# Altium schematic sheet LaserLider.SchDoc
size A4
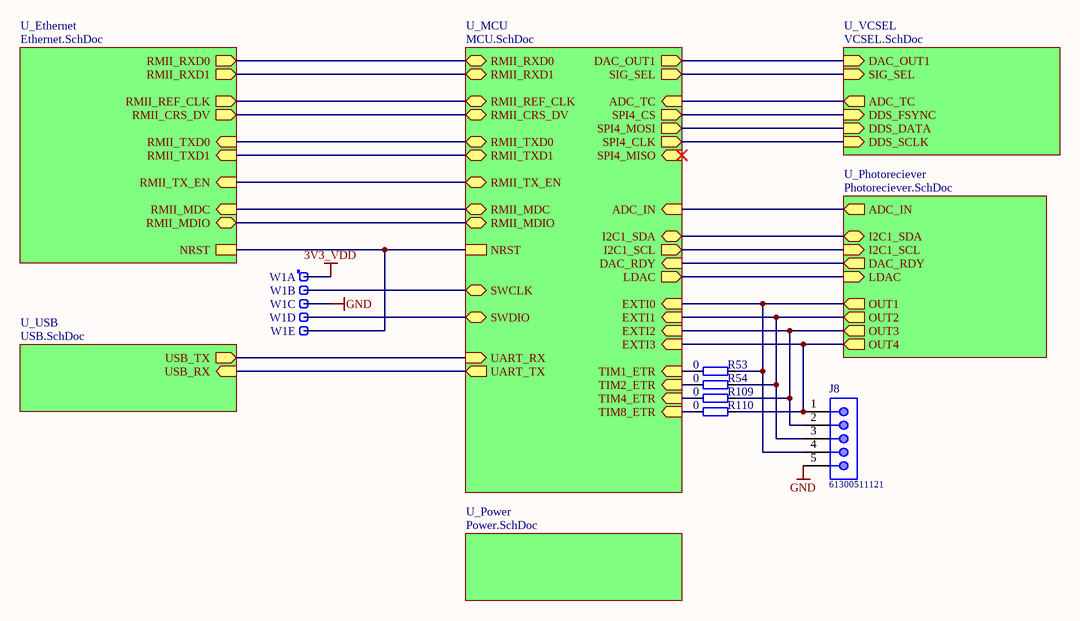
[diagram p0: LaserLider.SchDoc]

## Parts
J8  61300511121  [61300511121]
R53  0  [RESC1005X40N]
R54  0  [RESC1005X40N]
R109  0  [RESC1005X40N]
R110  0  [RESC1005X40N]
W1  Header 5  [SAMTEC_MTLW-105-07-L-S-250]  (value not drawn)  (parts A,B,C,D,E of 5)

## Sub-sheets
U_Ethernet = Ethernet.SchDoc: RMII_TXD0 (in), RMII_TX_EN (in), RMII_RXD0 (out), RMII_REF_CLK (out), RMII_CRS_DV (out), RMII_MDC (in), RMII_MDIO (bidir), NRST, RMII_TXD1 (in), RMII_RXD1 (out)
U_MCU = MCU.SchDoc: SWCLK (bidir), RMII_RXD0 (bidir), RMII_REF_CLK (bidir), RMII_CRS_DV (bidir), RMII_MDC (bidir), RMII_MDIO (bidir), RMII_RXD1 (bidir), SWDIO (bidir), RMII_TXD0 (bidir), RMII_TX_EN (bidir), RMII_TXD1 (bidir), NRST, DAC_OUT1 (out), UART_TX (out), UART_RX (in), ADC_IN (in), ADC_TC (in), SIG_SEL (out), EXTI3 (in), SPI4_CLK (out), I2C1_SCL (out), I2C1_SDA (bidir), DAC_RDY (in), SPI4_MOSI (out), EXTI1 (in), SPI4_MISO (in), LDAC (out), EXTI2 (in), EXTI0 (in), TIM8_ETR (in), TIM4_ETR (in), TIM1_ETR (in), TIM2_ETR (in), SPI4_CS (out)
U_Photoreciever = Photoreciever.SchDoc: ADC_IN (out), DAC_RDY (out), OUT2 (out), I2C1_SCL (in), LDAC (in), OUT3 (out), I2C1_SDA (bidir), OUT1 (out), OUT4 (out)
U_Power = Power.SchDoc: no entries
U_USB = USB.SchDoc: USB_TX (out), USB_RX (in)
U_VCSEL = VCSEL.SchDoc: DAC_OUT1 (in), ADC_TC (out), SIG_SEL (in), DDS_FSYNC (in), DDS_DATA (in), DDS_SCLK (in)

## Nets
3V3_VDD: W1.1
GND: J8.5 W1.3
NetJ8_1: J8.1 R110.2 ; sheet U_MCU/EXTI3, sheet U_Photoreciever/OUT4
NetJ8_2: J8.2 R109.2 ; sheet U_MCU/EXTI2, sheet U_Photoreciever/OUT3
NetJ8_3: J8.3 R54.2 ; sheet U_MCU/EXTI1, sheet U_Photoreciever/OUT2
NetJ8_4: J8.4 R53.2 ; sheet U_MCU/EXTI0, sheet U_Photoreciever/OUT1
NetR53_1: R53.1 ; sheet U_MCU/TIM1_ETR
NetR54_1: R54.1 ; sheet U_MCU/TIM2_ETR
NetR109_1: R109.1 ; sheet U_MCU/TIM4_ETR
NetR110_1: R110.1 ; sheet U_MCU/TIM8_ETR
NetW1_2: W1.2 ; sheet U_MCU/SWCLK
NetW1_4: W1.4 ; sheet U_MCU/SWDIO
NetW1_5: W1.5 ; sheet U_MCU/NRST, sheet U_Ethernet/NRST
(unnamed): sheet U_MCU/RMII_RXD0, sheet U_Ethernet/RMII_RXD0
(unnamed): sheet U_MCU/RMII_REF_CLK, sheet U_Ethernet/RMII_REF_CLK
(unnamed): sheet U_MCU/RMII_CRS_DV, sheet U_Ethernet/RMII_CRS_DV
(unnamed): sheet U_MCU/RMII_MDC, sheet U_Ethernet/RMII_MDC
(unnamed): sheet U_MCU/RMII_MDIO, sheet U_Ethernet/RMII_MDIO
(unnamed): sheet U_MCU/RMII_RXD1, sheet U_Ethernet/RMII_RXD1
(unnamed): sheet U_MCU/RMII_TXD0, sheet U_Ethernet/RMII_TXD0
(unnamed): sheet U_MCU/RMII_TX_EN, sheet U_Ethernet/RMII_TX_EN
(unnamed): sheet U_MCU/RMII_TXD1, sheet U_Ethernet/RMII_TXD1
(unnamed): sheet U_MCU/DAC_OUT1, sheet U_VCSEL/DAC_OUT1
(unnamed): sheet U_MCU/UART_TX, sheet U_USB/USB_RX
(unnamed): sheet U_MCU/UART_RX, sheet U_USB/USB_TX
(unnamed): sheet U_MCU/ADC_IN, sheet U_Photoreciever/ADC_IN
(unnamed): sheet U_MCU/ADC_TC, sheet U_VCSEL/ADC_TC
(unnamed): sheet U_MCU/SIG_SEL, sheet U_VCSEL/SIG_SEL
(unnamed): sheet U_MCU/SPI4_CLK, sheet U_VCSEL/DDS_SCLK
(unnamed): sheet U_MCU/I2C1_SCL, sheet U_Photoreciever/I2C1_SCL
(unnamed): sheet U_MCU/I2C1_SDA, sheet U_Photoreciever/I2C1_SDA
(unnamed): sheet U_MCU/DAC_RDY, sheet U_Photoreciever/DAC_RDY
(unnamed): sheet U_MCU/SPI4_MOSI, sheet U_VCSEL/DDS_DATA
(unnamed): sheet U_MCU/LDAC, sheet U_Photoreciever/LDAC
(unnamed): sheet U_MCU/SPI4_CS, sheet U_VCSEL/DDS_FSYNC

## Library data of the parts
J8 = 61300511121: WR-PHD Pin Header, THT, pitch 2.54mm, Single Row, Vertical, 5pin; Pin Number: 5; Gender: Male; Rated Current: 3A; Working Voltage: 250VAC; Withstanding Voltage: 500VAC; Contact Resistance: 20mOhm; ComponentLink1Description: Manufacturer; ComponentLink1URL: http://www.we-online.de; ComponentLink2Description: Datasheet; ComponentLink2URL: https://katalog.we-online.de/em/datasheet/6130xx11121.pdf; Part Number: 61300511121; Published Date: June 2019; Publisher: Wurth Elektronik; Pitch: 2.54mm; Operating Temperature: -40 to +105degC; Mounting Technology: THT; Packaging: Bag; Row Number: Single; Orientation: Vertical
R53 R54 R109 R110 = R0402_0R_JUMPER: Resistor; Part Description: 1A (0.05R Max DC Resistance) Zero Ohm Jumper; Manufacturer: GENERIC; Manufacturer1 Part Number: 232270591001L; PressFit: No; Part Number: R0402_0R_JUMPER; Component Kind: Standard; Component Type: Standard; Pin Count: 2; Value: 0; Status: Not Recommended; Manufacturer Part Number: R0402_0R_JUMPER; Case: 0402; Mounted: Yes; Sense: No; Socket: No; SMD: Yes; Manufacturer1 Example: YAGEO PHYCOMP; Manufacturer1 ComponentHeight: 0.4mm; HelpURL: \\cern.ch\dfs\Applications\Altium\Datasheets\R0402_Phycomp_RC0402.pdf; Author: CERN DEM JLC; CreateDate: 03.12.2007; LatestRevisionDate: 17.10.2012
W1 = SAMTEC_MTLW-105-07-L-S-250: 5 Mini Wire-Wrap Contact Strip Header; Part Description: 5 Contacts, Pitch 2.54mm, Single Row Through Mount Straight Header (Post Lead = 6.35mm, Tail Lead 3.05mm, Insulator 1.52mm); Manufacturer: SAMTEC; PressFit: No; Part Number: SAMTEC_MTLW-105-07-L-S-250; Component Kind: Standard; Component Type: Standard; Pin Count: 5; Family: Header 5; Mounted: Yes; Socket: No; SMD: No; Sense: No; Status: None; Manufacturer Part Number: MTLW-105-07-L-S-250; ComponentHeight: 7.87mm; HelpURL: \\cern.ch\dfs\Applications\Altium\Datasheets\SAMTEC_MTLW-105-07-L-S-250.pdf; Author: CERN DEM JLC; CreateDate: 07.01.2015; LatestRevisionDate: 07.01.2015